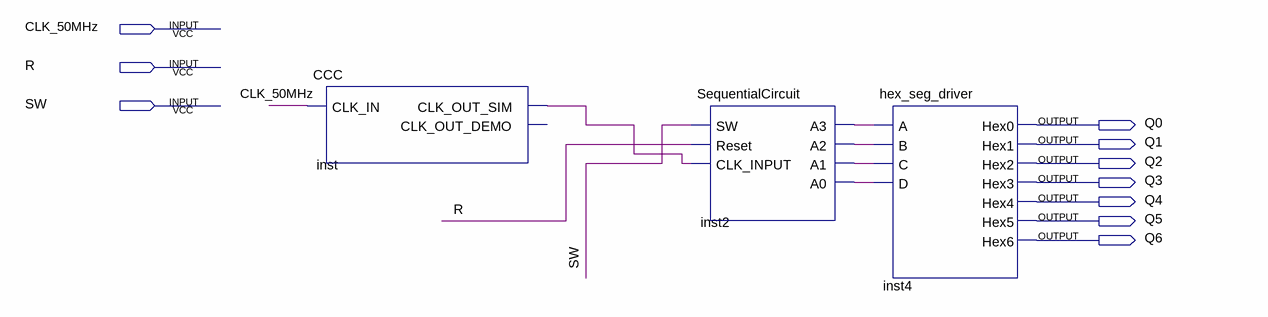
[diagram p0: schematic sheet]
// Quartus schematic Top.bdf as structural Verilog: 3 symbols, 10 pins
module Top (
  input  CLK_50MHz,
  input  R,
  input  SW,
  output Q0,
  output Q1,
  output Q2,
  output Q3,
  output Q4,
  output Q5,
  output Q6
);

  wire inst2_a0, inst2_a1, inst2_a2, inst2_a3, inst_clk_out_sim;

  CCC inst (.CLK_IN(CLK_50MHz), .CLK_OUT_SIM(inst_clk_out_sim));  // open: CLK_OUT_DEMO
  SequentialCircuit inst2 (
    .SW(SW), .Reset(R), .CLK_INPUT(inst_clk_out_sim), .A3(inst2_a3), .A2(inst2_a2), .A1(inst2_a1),
    .A0(inst2_a0));
  hex_seg_driver inst4 (
    .A(inst2_a3), .B(inst2_a2), .C(inst2_a1), .D(inst2_a0), .Hex0(Q0), .Hex1(Q1), .Hex2(Q2), .Hex3(Q3),
    .Hex4(Q4), .Hex5(Q5), .Hex6(Q6));
endmodule
